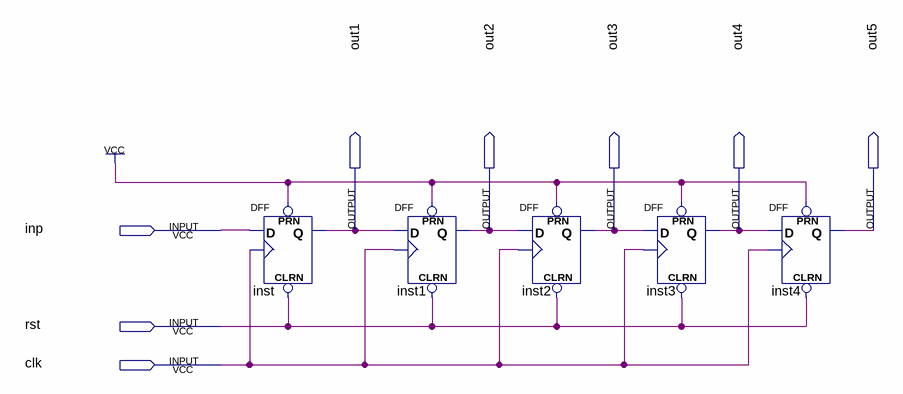
[diagram p0: schematic sheet]
// Quartus schematic shift_reg_5bit_ss.bdf as structural Verilog: 5 symbols, 8 pins
module shift_reg_5bit_ss (
  input  inp,
  input  rst,
  input  clk,
  output out1,
  output out2,
  output out3,
  output out4,
  output out5
);

  DFF inst (.CLRN(rst), .CLK(clk), .D(inp), .PRN(1'b1), .Q(out1));
  DFF inst1 (.CLRN(rst), .CLK(clk), .D(out1), .PRN(1'b1), .Q(out2));
  DFF inst2 (.CLRN(rst), .CLK(clk), .D(out2), .PRN(1'b1), .Q(out3));
  DFF inst3 (.CLRN(rst), .CLK(clk), .D(out3), .PRN(1'b1), .Q(out4));
  DFF inst4 (.CLRN(rst), .CLK(clk), .D(out4), .PRN(1'b1), .Q(out5));
endmodule
